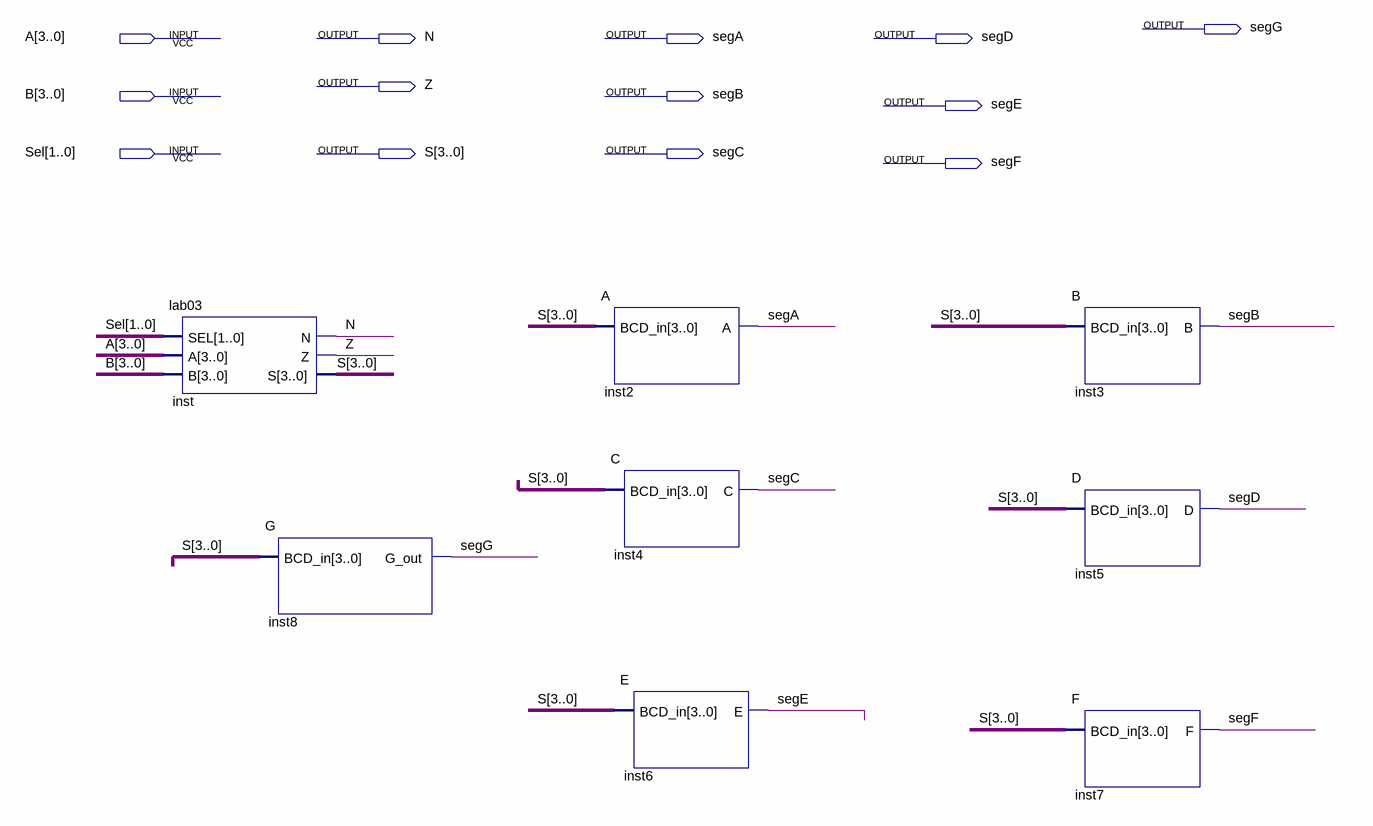
[diagram p0: schematic sheet]
// Quartus schematic lab_04.bdf as structural Verilog: 8 symbols, 13 pins
module lab_04 (
  input  [3:0] A,
  input  [3:0] B,
  input  [1:0] Sel,
  output segG,
  output N,
  output segA,
  output segD,
  output Z,
  output segB,
  output segE,
  output [3:0] S,
  output segC,
  output segF
);

  lab03 inst (.SEL(Sel), .A(A), .B(B), .N(N), .Z(Z), .S(S));
  G inst8 (.BCD_in(S), .G_out(segG));
  A inst2 (.BCD_in(S), .A(segA));
  C inst4 (.BCD_in(S), .C(segC));
  E inst6 (.BCD_in(S), .E(segE));
  B inst3 (.BCD_in(S), .B(segB));
  D inst5 (.BCD_in(S), .D(segD));
  F inst7 (.BCD_in(S), .F(segF));
endmodule
